# EAGLE design untitled (EAGLE 9.6.2)
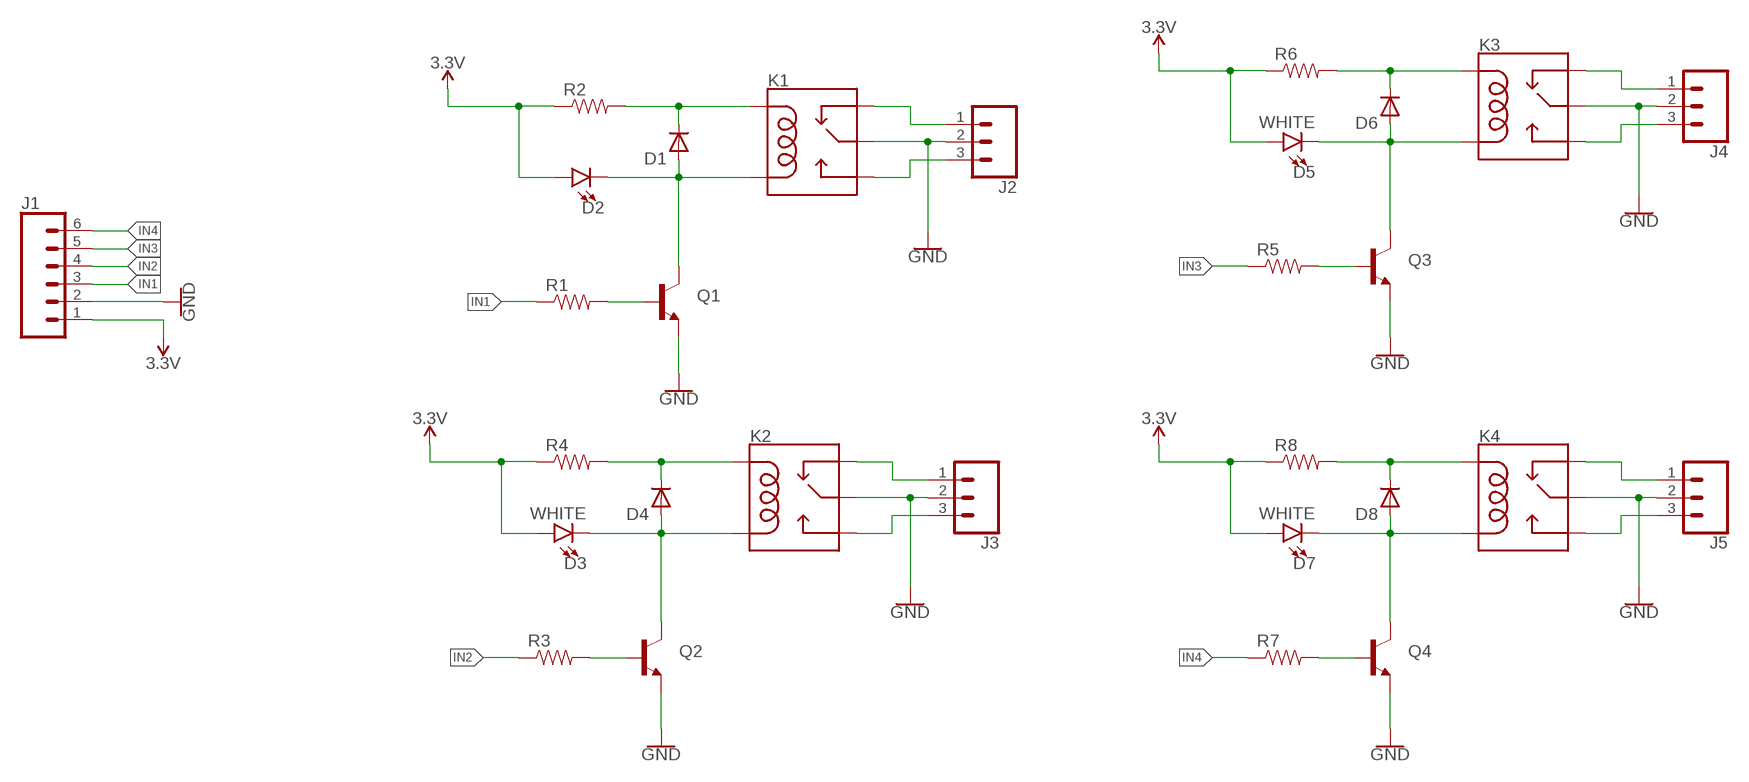
[diagram p0: schematic, sheet 1]

## Parts
D1  DIODE-SOD123  [SOD123]
D2  LED-WHITE1206  [LED-1206]
D3  WHITE  LED-WHITE1206  [LED-1206]
D4  DIODE-SOD123  [SOD123]
D5  WHITE  LED-WHITE1206  [LED-1206]
D6  DIODE-SOD123  [SOD123]
D7  WHITE  LED-WHITE1206  [LED-1206]
D8  DIODE-SOD123  [SOD123]
J1  CONN_06SILK_FEMALE_PTH  [1X06]
J2  CONN_03-SCREW-5MM  [SCREWTERMINAL-5MM-3]
J3  CONN_03-SCREW-5MM  [SCREWTERMINAL-5MM-3]
J4  CONN_03-SCREW-5MM  [SCREWTERMINAL-5MM-3]
J5  CONN_03-SCREW-5MM  [SCREWTERMINAL-5MM-3]
K1  RELAY-SPDT  [RELAY_G5LE]
K2  RELAY-SPDT  [RELAY_G5LE]
K3  RELAY-SPDT  [RELAY_G5LE]
K4  RELAY-SPDT  [RELAY_G5LE]
Q1  TRANSISTOR_NPNSOT89  [SOT89]
Q2  TRANSISTOR_NPNSOT89  [SOT89]
Q3  TRANSISTOR_NPNSOT89  [SOT89]
Q4  TRANSISTOR_NPNSOT89  [SOT89]
R1  RESISTOR1206  [1206]
R2  RESISTOR1206  [1206]
R3  RESISTOR1206  [1206]
R4  RESISTOR1206  [1206]
R5  RESISTOR1206  [1206]
R6  RESISTOR1206  [1206]
R7  RESISTOR1206  [1206]
R8  RESISTOR1206  [1206]

## Nets
3.3V: D2.A D3.A D5.A D7.A J1.1 R2.1 R4.1 R6.1 R8.1
GND: J1.2 J2.2 J3.2 J4.2 J5.2 K1.1(MAIN) K2.1(MAIN) K3.1(MAIN) K4.1(MAIN) Q1.3(E) Q2.3(E) Q3.3(E) Q4.3(E)
IN1: J1.3 R1.1
IN2: J1.4 R3.1
IN3: J1.5 R5.1
IN4: J1.6 R7.1
N$1: D1.C K1.2(COIL1) R2.2
N$2: D1.A D2.C K1.5(COIL2) Q1.2(C)
N$3: Q1.1(B) R1.2
N$4: D4.C K2.2(COIL1) R4.2
N$5: J2.3 K1.3(NO)
N$6: D3.C D4.A K2.5(COIL2) Q2.2(C)
N$7: J2.1 K1.4(NC)
N$8: Q2.1(B) R3.2
N$9: J3.3 K2.3(NO)
N$10: J3.1 K2.4(NC)
N$11: D6.C K3.2(COIL1) R6.2
N$12: D5.C D6.A K3.5(COIL2) Q3.2(C)
N$13: Q3.1(B) R5.2
N$14: J4.3 K3.3(NO)
N$15: J4.1 K3.4(NC)
N$16: D8.C K4.2(COIL1) R8.2
N$17: D7.C D8.A K4.5(COIL2) Q4.2(C)
N$18: Q4.1(B) R7.2
N$19: J5.3 K4.3(NO)
N$20: J5.1 K4.4(NC)

## Library data of the parts
D1 D4 D6 D8 = diode-1:DIODE-: DIODE
D2 = SparkFun-LED:LED-WHITE: White SMD LED Used in manufacturing several products at SparkFun. Packages: 0603 - Bright White SMD 0603 package[Product Link] <http://www.kingbrightusa.com/product.asp?catalog_name=LED&product_id=APT1608QWF/D> 1206 - Bright White SMD1206 package [Product Link] <http://www.kingbrightusa.com/product.asp?catalog_name=LED&product_id=APT3216QWF/D> 3014 - Super Bright SMD 3014 package [Datasheet] <http://www.lumileds.com/uploads/459/DS208-pdf> SparkFun Products: Blackberry Trackballer Breakout <https://www.sparkfun.com/products/13169> Digital SandBox <https://www.sparkfun.com/products/12651>; PROD_ID: DIO-09955; VALUE: WHITE
D3 D5 D7 = SparkFun-LED:LED-WHITE: White SMD LED Used in manufacturing several products at SparkFun. Packages: 0603 - Bright White SMD 0603 package[Product Link] <http://www.kingbrightusa.com/product.asp?catalog_name=LED&product_id=APT1608QWF/D> 1206 - Bright White SMD1206 package [Product Link] <http://www.kingbrightusa.com/product.asp?catalog_name=LED&product_id=APT3216QWF/D> 3014 - Super Bright SMD 3014 package [Datasheet] <http://www.lumileds.com/uploads/459/DS208-pdf> SparkFun Products: Blackberry Trackballer Breakout <https://www.sparkfun.com/products/13169> Digital SandBox <https://www.sparkfun.com/products/12651>; PROD_ID: DIO-09955
J1 = SparkFun-Connectors:CONN_06: Multi connection point. Often used as Generic Header-pin footprint for 0.1 inch spaced/style header connections On any of the 0.1 inch spaced packages, you can populate with these: Break Away Headers - Straight <https://www.sparkfun.com/products/116> (PRT-00116) Break Away Male Headers - Right Angle <https://www.sparkfun.com/products/553> (PRT-00553) Female Headers <https://www.sparkfun.com/products/115> (PRT-00115) Break Away Headers - Machine Pin <https://www.sparkfun.com/products/117> (PRT-00117) Break Away Female Headers - Swiss Machine Pin <https://www.sparkfun.com/products/743> (PRT-00743) Arduino Stackable Header - 6 Pin <https://www.sparkfun.com/products/9280> (PRT-09280) Screw Terminals 2.54mm Pitch (6-Pin) <https://www.sparkfun.com/products/16499> (PRT-16499) For SCREWTERMINALS and SPRING TERMINALS visit here: Screw Terimnals on SparkFun.com <https://www.sparkfun.com/search/results?term=Screw+Terminals> (5mm/3.5mm/2.54mm spacing) This device is also useful as a general connection point to wire up your design to another part of your project. Our various solder wires solder well into these plated through hole pads. Hook-Up Wire - Assortment (Stranded, 22 AWG) <https://www.sparkfun.com/products/11375> (PRT-11375) Hook-Up Wire - Assortment (Solid Core, 22 AWG) <https://www.sparkfun.com/products/11367> (PRT-11367) View the entire wire category on our website here <https://www.sparkfun.com/categories/141>; PROD_ID: CONN-08437
J2-J5 = SparkFun-Connectors:CONN_03: Multi connection point. Often used as Generic Header-pin footprint for 0.1 inch spaced/style header connections On any of the 0.1 inch spaced packages, you can populate with these: Break Away Headers - Straight <https://www.sparkfun.com/products/116> (PRT-00116) Break Away Male Headers - Right Angle <https://www.sparkfun.com/products/553> (PRT-00553) Female Headers <https://www.sparkfun.com/products/115> (PRT-00115) Break Away Headers - Machine Pin <https://www.sparkfun.com/products/117> (PRT-00117) Break Away Female Headers - Swiss Machine Pin <https://www.sparkfun.com/products/743> (PRT-00743) Stackable Header - 3 Pin (Female, 0.1") <https://www.sparkfun.com/products/13875> (PRT-13875) For SCREWTERMINALS and SPRING TERMINALS visit here: Screw Terimnals on SparkFun.com <https://www.sparkfun.com/search/results?term=Screw+Terminals> (5mm/3.5mm/2.54mm spacing) This device is also useful as a general connection point to wire up your design to another part of your project. Our various solder wires solder well into these plated through hole pads. Hook-Up Wire - Assortment (Stranded, 22 AWG) <https://www.sparkfun.com/products/11375> (PRT-11375) Hook-Up Wire - Assortment (Solid Core, 22 AWG) <https://www.sparkfun.com/products/11367> (PRT-11367) View the entire wire category on our website here <https://www.sparkfun.com/categories/141> Special notes: Molex polarized connector foot print use with SKU : PRT-08232 with associated crimp pins and housings.; PROD_ID: CONN-10134; SF_SKU: PRT-08433
K1-K4 = SparkFun-Electromechanical:RELAY-SPDT: SPDT Electromechanical Relay Single-pole, double-throw sealed relays. When current is applied to the coil, it throws a simple changeover switch, terminating the connection from the NC contact to ground and closing the NO contact. Use them to switch high voltage/high current devices. SparkFun Products JQX-15F: Relay SPDT Sealed - 20A <https://www.sparkfun.com/products/10924> (COM-10924) JZC-11F: Relay SPDT Sealed <https://www.sparkfun.com/products/100> (COM-00100); PROD_ID: COMP-14214
Q1-Q4 = SparkFun-DiscreteSemi:TRANSISTOR_NPN: Generic NPN BJT MMBT2222A - TRANS-08049 (SOT-23, 1A 40V) MPSA42 - TRANS-09116 (SOT-23, 500mA 300V) MMBT5088LT1G - TRANS-11160 (SOT-23, 50 mA 30V) BC547 - COM-08928 <http://www.sparkfun.com/products/8928> (TO-92 45V 100mA) (1.Collector 2.Base 3.Emitter) 2N3904 - COM-00521 <http://www.sparkfun.com/products/521> (TO-92 40V 200mA) (1.Emitter 2.Base 3.Collector) P2N2222A - COM-12852 <http://www.sparkfun.com/products/12852> (TO-92 40V 600mA) (1.Collector 2.Base 3.Emitter)
R1-R8 = SparkFun-Resistors:RESISTOR: Resistor Basic schematic elements and footprints for 0603, 1206, and PTH resistors.

## Board
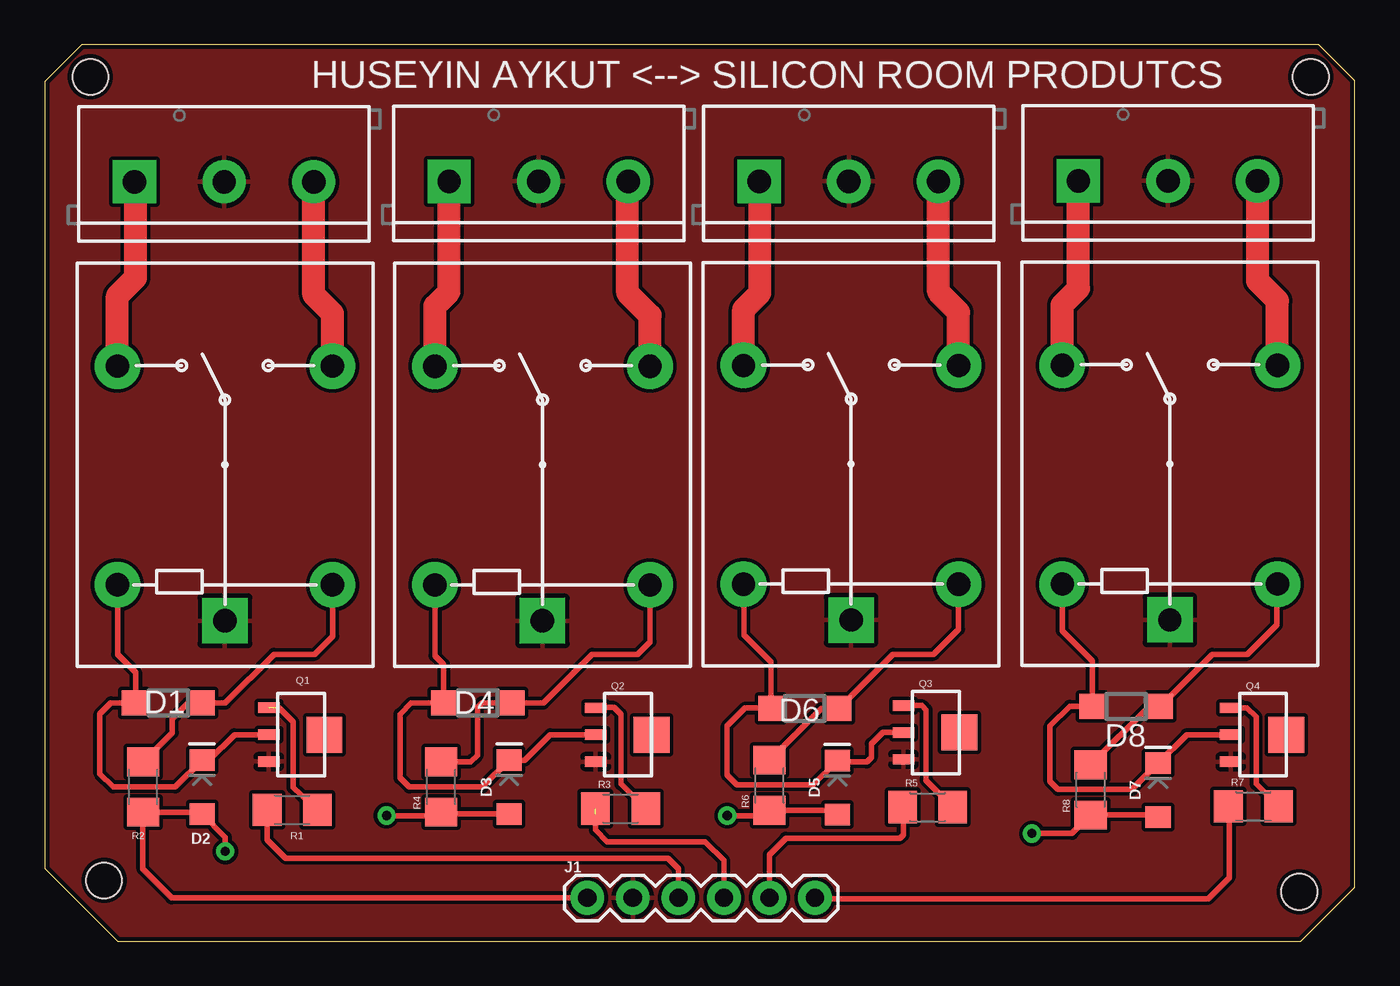
[diagram p1: board, top side]
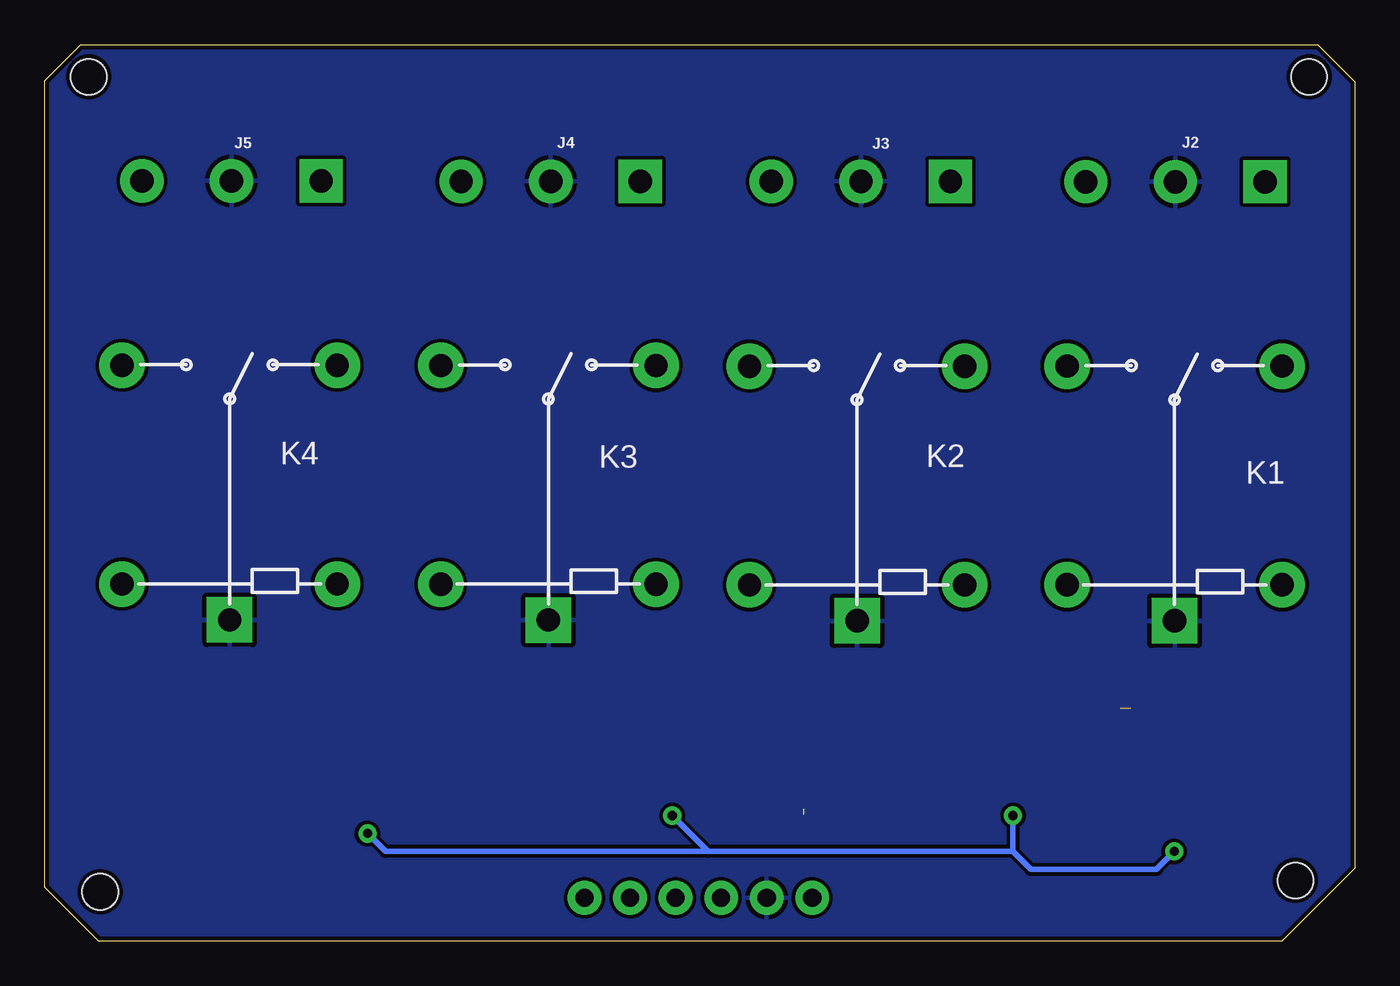
[diagram p2: board, bottom side, seen from below]

Size 73.06 x 50 mm. Coordinates in mm from the lower left corner, seen from the top.
Outline: 2.06,50 0,47.94 0,4.06 4.06,0 70.06,0 73.06,3 73.06,48 71.06,50 2.06,50
Copper layers (1*16): Top 0.035mm / dielectric 1.5mm / Bottom 0.035mm
Design rules "SparkFun": minimum track width 8mil, minimum drill 20mil, track to track 8mil, track to pad 8mil, pad to pad 8mil, via to via 8mil, smd to smd 8mil, copper to edge 10mil, drill to drill 8mil, minimum pad ring 12mil, minimum via ring 10mil, stop-mask expansion 4mil, vias tented up to drill 25mil, thermal gap 10mil
Holes 2 mm at 2.54,48.21 3.3,3.38 69.98,2.75 70.61,48.21

### Footprints (pad centres in the part's own frame; a part is rotated, then mirrored left to right if it is on the bottom)
SOD123 = smd 1.4 x 1.4: A 1.9,0; C -1.9,0
LED-1206 = smd 1.2 x 1.4: A -1.5,0; C 1.5,0
1X06 = drill 1.016 pad 1.88: 1 0,0; 2 2.54,0; 3 5.08,0; 4 7.62,0; 5 10.16,0; 6 12.7,0
SCREWTERMINAL-5MM-3 = drill 1.3 pad 2.413 square: 1 0,0 | drill 1.3 pad 2.413: 2 5,0; 3 10,0
RELAY_G5LE = drill 1.3 pad 2.54 square: 1 8.52,-0.005 | drill 1.3 pad 2.54: 2 6.52,5.995; 3 -5.68,5.995; 4 -5.68,-6.005; 5 6.52,-6.005
SOT89 = smd 0.58 x 1.2: 1 -1.5,-1.8; 2 0,-1.8; 3 1.5,-1.8 | smd 2 x 2: 4 0,1.3
1206 = smd 1.6 x 1.8: 1 -1.4,0; 2 1.4,0

### Placement (x,y rotation side)
D1  6.89,13.28 180 top
D2  8.77,8.59 90 top
D3  25.9,8.59 90 top
D4  24.15,13.28 180 top
D5  44.2,8.56 90 top
D6  42.39,12.97 180 top
D7  62.09,8.42 90 top
D8  60.32,13.1 180 top
J1  30.26,2.41 0 top
J2  5,42.36 0 top
J3  22.54,42.38 0 top
J4  39.85,42.38 0 top
J5  57.65,42.41 0 top
K1  10.05,26.39 270 top
K2  27.76,26.39 270 top
K3  44.98,26.43 270 top
K4  62.76,26.44 270 top
Q1  14.3,11.51 270 top
Q2  32.53,11.51 270 top
Q3  49.71,11.64 270 top
Q4  67.94,11.51 270 top
R1  13.8,7.32 0 top
R2  5.49,8.59 90 top
R3  32.11,7.39 0 top
R4  22.1,8.6 90 top
R5  49.25,7.47 0 top
R6  40.43,8.69 90 top
R7  67.42,7.51 0 top
R8  58.33,8.43 90 top

### Tracks (layer width: path | path; a pad name or v marks a point on that pad's centre or on a via)
3.3V  (via drill 0.51)
  Top 0.305: R2.1 6.06,7.19 | 6.06,7.19 8.58,7.19 D2.A 10.06,5.8 v10.06,5 | D3.A 22.21,7.09 R4.1 21.9,7 v19.06,7 | D5.A 43.98,7.29 R6.1 40.14,7 v38.06,7 | D7.A 61.98,7.03 R8.1 57.3,6 v55.06,6 | J1.1 7.07,2.41 5.46,4.02 5.46,6.59 6.06,7.19
  Bottom 0.305: v19.06,7 19.06,5 | 19.06,5 18.06,4 11.06,4 v10.06,5 | v38.06,7 36.06,5 | 36.06,5 54.06,5 v55.06,6 | 19.06,5 36.06,5
GND
  pour Top: 1.06,52 -1.94,49 -1.94,2 2.06,-2 3.06,-2 73.06,-2 74.06,-1 76.06,1 76.06,51 75.06,52
  pour Bottom: 0.06,51 -0.94,50 -0.94,2 3.06,-2 7.06,-2 74.06,-2 75.06,-1 77.06,1 77.06,45 77.06,51 74.06,54 3.06,54
IN1
  Top 0.305: R1.1 12.4,5.66 13.44,4.62 34.75,4.62 35.34,4.03 J1.3
IN2  (1 unrouted)
  Top 0.305: J1.4 37.88,4.49 36.83,5.54 31.37,5.54 30.71,6.2 30.71,7.07
IN3
  Top 0.305: R5.1 47.88,7.44 47.88,5.92 47.69,5.73 41.34,5.73 40.42,4.81 J1.5
IN4
  Top 0.305: R7.1 66.06,7.47 66.06,3.53 64.9,2.37 43,2.37 J1.6
N$1
  Top 0.305: R2.2 7.11,11.62 7.11,12.4 8,13.28 D1.C 10.06,13.28 12.78,16 15.06,16 16.06,17 16.06,19.85 K1.2
N$2
  Top 0.305: Q1.2 10.58,11.51 9.15,10.09 D2.C 7.27,8.59 3.81,8.59 3.06,9.34 3.06,12.67 3.68,13.29 D1.A | D1.A | K1.5 4.06,19.85 4.06,16 5.06,15 5.06,13.37 D1.A
N$3  (1 unrouted)
  Top 0.305: R1.2 13.84,8.57 13.84,12.22 13.06,13
N$4
  Top 0.305: R4.2 23.76,10 24.13,10.37 24.13,13.04 24.38,13.29 D4.C 27.81,13.29 30.52,16 33.06,16 33.76,16.7 K2.2
N$5
  Top 1.27: K1.3 16.04,35.02 15,36.06 J2.3
N$6
  Top 0.305: Q2.2 28.19,11.51 26.77,10.09 D3.C 24.4,8.59 20.32,8.59 19.81,9.1 19.81,12.65 20.44,13.29 D4.A 22.25,15.42 21.76,15.91 K2.5
N$7
  Top 1.27: K1.4 4.04,35.98 5.06,37 5.06,42.3 J2.1
N$8
  Top 0.305: R3.2 32.13,8.77 32.13,12.65 31.75,13.04 30.76,13.04 Q2.1
N$9
  Top 1.27: K2.3 33.76,34.9 32.51,36.15 32.51,42.35 J3.3
N$10
  Top 1.27: K2.4 21.76,35.43 22.54,36.22 J3.1
N$11
  Top 0.305: K3.2 50.97,17.4 49.57,16 47.32,16 D6.C 43.31,12.97 R6.2
N$12
  Top 0.305: Q3.2 46.74,11.64 46.1,11 46.1,10.24 45.85,9.99 44.28,9.99 D5.C 42.86,8.72 38.61,8.72 38.06,9.26 38.06,12 39.06,13 40.47,13 D6.A 40.49,15.57 38.99,17.07 38.99,19.89 K3.5
N$13
  Top 0.305: Q3.1 48.92,13.14 49.15,12.91 49.15,8.97 R5.2
N$14
  Top 1.27: K3.3 50.97,35.09 49.85,36.21 J4.3
N$15
  Top 1.27: K3.4 38.97,35.24 39.88,36.15 39.88,42.35 J4.1
N$16
  Top 0.305: R8.2 61.6,13.1 D8.C 65.12,16 67.06,16 68.71,17.64 68.71,19.87 K4.2
N$17
  Top 0.305: Q4.2 63.69,11.51 D7.C 60.64,8.46 56.52,8.46 56.06,8.91 56.06,12 57.16,13.1 D8.A 58.42,15.64 56.75,17.31 K4.5
N$18
  Top 0.305: R7.2 67.56,8.77 67.56,12.5 67.05,13.01 Q4.1
N$19
  Top 1.27: K4.3 68.75,35.72 67.65,36.83 J5.3
N$20
  Top 1.27: K4.4 56.75,35.5 57.66,36.4 J5.1

### Text on the board
tNames: HUSEYIN AYKUT <--> SILICON ROOM PRODUTCS